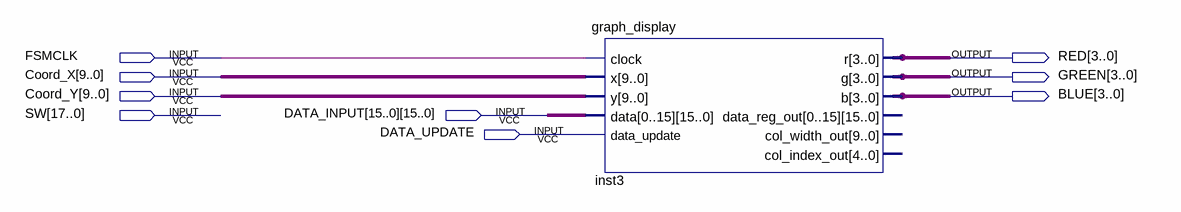
[diagram p0: schematic sheet]
// Quartus schematic video_generator.bdf as structural Verilog: 1 symbols, 9 pins
module video_generator (
  input  FSMCLK,
  input  [9:0] Coord_X,
  input  [9:0] Coord_Y,
  input  [17:0] SW,
  input  [15:0] DATA_INPUT_15,
  input  [15:0] DATA_INPUT_14,
  input  [15:0] DATA_INPUT_13,
  input  [15:0] DATA_INPUT_12,
  input  [15:0] DATA_INPUT_11,
  input  [15:0] DATA_INPUT_10,
  input  [15:0] DATA_INPUT_9,
  input  [15:0] DATA_INPUT_8,
  input  [15:0] DATA_INPUT_7,
  input  [15:0] DATA_INPUT_6,
  input  [15:0] DATA_INPUT_5,
  input  [15:0] DATA_INPUT_4,
  input  [15:0] DATA_INPUT_3,
  input  [15:0] DATA_INPUT_2,
  input  [15:0] DATA_INPUT_1,
  input  [15:0] DATA_INPUT_0,
  input  DATA_UPDATE,
  output [3:0] RED,
  output [3:0] GREEN,
  output [3:0] BLUE
);

  graph_display inst3 (
    .clock(FSMCLK), .x(Coord_X), .y(Coord_Y),
    .data({DATA_INPUT_15, DATA_INPUT_14, DATA_INPUT_13, DATA_INPUT_12, DATA_INPUT_11, DATA_INPUT_10, DATA_INPUT_9, DATA_INPUT_8, DATA_INPUT_7, DATA_INPUT_6, DATA_INPUT_5, DATA_INPUT_4, DATA_INPUT_3, DATA_INPUT_2, DATA_INPUT_1, DATA_INPUT_0}),
    .data_update(DATA_UPDATE), .r(RED), .g(GREEN), .b(BLUE));  // open: data_reg_out, col_width_out, col_index_out
endmodule
